# EAGLE schematic CyloRen-rev5.0 (EAGLE 9.1.0)
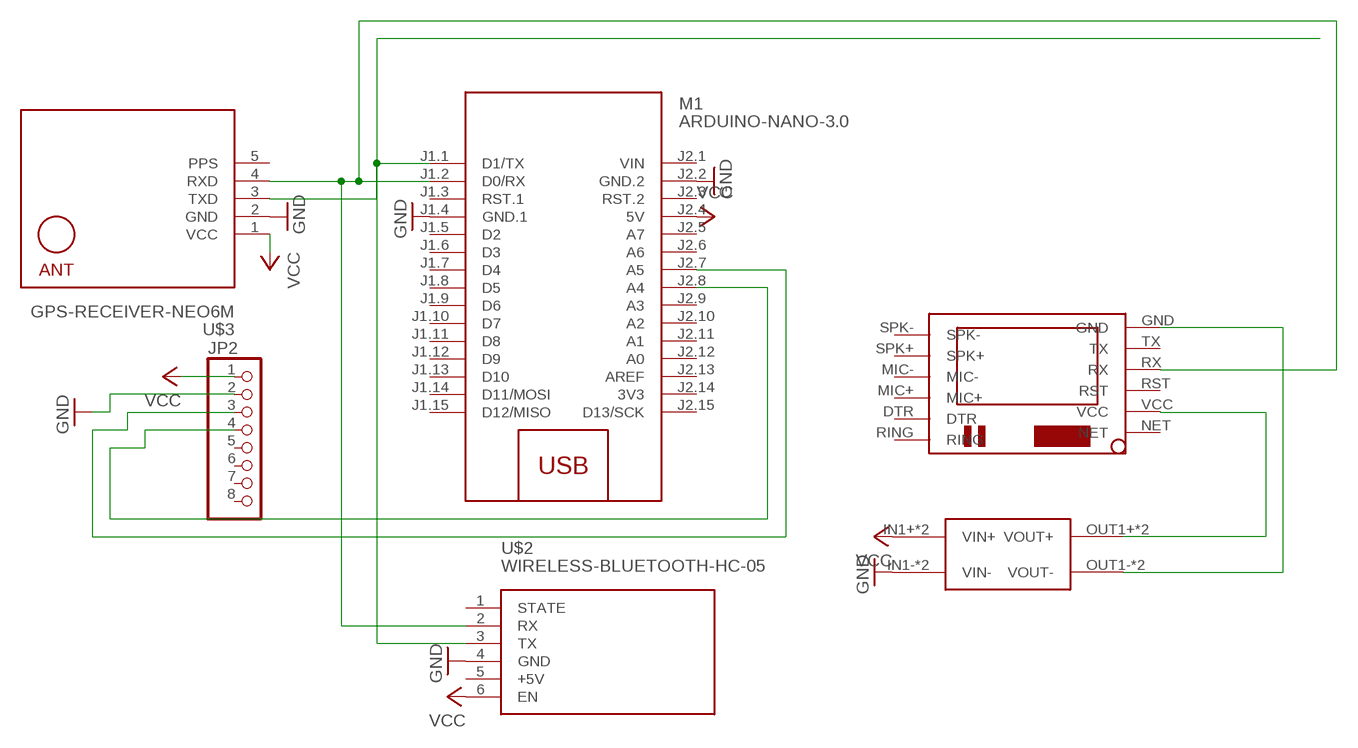
[diagram p0: schematic, sheet 1]

## Parts
JP2  PINHD-1X8BIG  [1X08-BIG]
M1  ARDUINO-NANO-3.0  [ARDUINO-NANO-3.0]
U$1  MP1584  [DC-BRICK]
U$2  WIRELESS-BLUETOOTH-HC-05  [WIRELESS-BLUETOOTH-HC-05]
U$3  GPS-RECEIVER-NEO6M  [GPS-RECEIVER-NEO6M]
U$4  SIM800LMODULE  [SIM800LMODULE]

## Nets
GND: JP2.2 M1.J1.4(GND.1) M1.J2.2(GND.2) U$1.IN1-(VIN-) U$1.IN2-(VIN-) U$2.4(GND) U$3.2(GND)
N$1: JP2.3 M1.J2.7(A5)
N$3: JP2.4 M1.J2.8(A4)
N$6: U$1.OUT1+(VOUT+) U$1.OUT2+(VOUT+) U$4.VCC
N$7: M1.J1.1(D1/TX) U$2.3(TX) U$3.3(TXD)
N$8: M1.J1.2(D0/RX) U$2.2(RX) U$3.4(RXD) U$4.RX
N$9: U$1.OUT1-(VOUT-) U$1.OUT2-(VOUT-) U$4.GND
VCC: JP2.1 M1.J2.4(5V) U$1.IN1+(VIN+) U$1.IN2+(VIN+) U$2.6(EN) U$3.1(VCC)
Unconnected: JP2.5 JP2.6 JP2.7 JP2.8 M1.J1.3(RST.1) M1.J1.5(D2) M1.J1.6(D3) M1.J1.7(D4) M1.J1.8(D5) M1.J1.9(D6) M1.J1.10(D7) M1.J1.11(D8) M1.J1.12(D9) M1.J1.13(D10) M1.J1.14(D11/MOSI) M1.J1.15(D12/MISO) M1.J2.3(RST.2) M1.J2.5(A7) M1.J2.6(A6) M1.J2.9(A3) M1.J2.10(A2) M1.J2.11(A1) M1.J2.12(A0) M1.J2.13(AREF) M1.J2.15(D13/SCK) U$2.1(STATE) U$4.DTR U$4.MIC+ U$4.MIC- U$4.NET U$4.RING U$4.RST U$4.SPK+ U$4.SPK- U$4.TX

## Power pins joined to a net without a drawn wire
3V3: M1.J2.14(3V3)
+5V: U$2.5(+5V)
PPS: U$3.5(PPS)
VIN: M1.J2.1(VIN)

## Library data of the parts
JP2 = adafruit:PINHD-1X8: PIN HEADER
M1 = diy-modules:ARDUINO-NANO-3.0: Arduino Nano 3.0 and compatible devices More details available here: https://www.arduino.cc/en/Main/ArduinoBoardNano Click here to find device on ebay.com <http://www.ebay.com/sch/arduino+nano>
U$1 = MP1584-dc-brick:MP1584: MP1584-dc-brick-pcb Step down Input: 4.5V - 28V Ouput 0.8V - 25V max. 3A Cheap on ebay
U$2 = diy-modules:WIRELESS-BLUETOOTH-HC-05: Bluetooth Transceiver Module based on HC-05 board Tutorial is available here: https://arduino-info.wikispaces.com/BlueTooth-HC05-HC06-Modules-How-To Click here to find device on ebay.com <http://www.ebay.com/sch/hc-05+module+rs232>
U$3 = diy-modules:GPS-RECEIVER-NEO6M: GPS Receiver Module based on NEO-6 device Short tutorial how to use NEO-6 module with Arduino: http://www.xarg.org/2016/06/neo6mv2-gps-module-with-arduino/ NEO-6 datasheet is available here: https://www.u-blox.com/sites/default/files/products/documents/NEO-6_DataSheet_%28GPS.G6-HW-09005%29.pdf Click here to find device on ebay.com <http://www.ebay.com/sch/gyneo6mv2>
U$4 = SIM800LMODULE:SIM800LMODULE: SIM800L Module